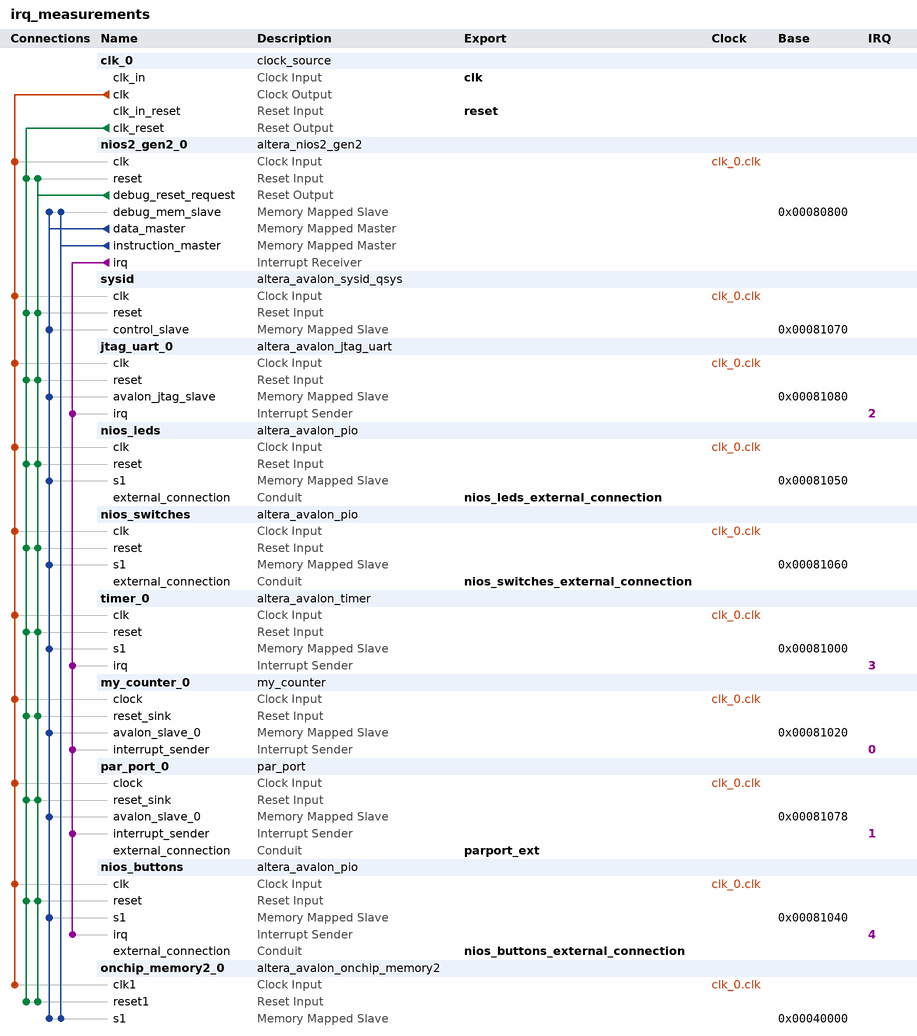
[diagram p0: system contents]
# Platform Designer (Qsys) system irq_measurements, Cyclone V 5CSEMA5F31C6
# Parameters at their usual value, and those the tool derives, are not listed.
package require -exact qsys 18.1
create_system irq_measurements
set_project_property DEVICE_FAMILY {Cyclone V}
set_project_property DEVICE 5CSEMA5F31C6

add_instance clk_0 clock_source 18.1
set_instance_parameter_value clk_0 clockFrequency 50000000

add_instance nios2_gen2_0 altera_nios2_gen2 18.1
set_instance_parameter_value nios2_gen2_0 dcache_size 2048
set_instance_parameter_value nios2_gen2_0 exceptionSlave onchip_memory2_0.s1
set_instance_parameter_value nios2_gen2_0 icache_size 4096
set_instance_parameter_value nios2_gen2_0 impl Fast
set_instance_parameter_value nios2_gen2_0 resetSlave onchip_memory2_0.s1

add_instance sysid altera_avalon_sysid_qsys 18.1
set_instance_parameter_value sysid id 0

add_instance jtag_uart_0 altera_avalon_jtag_uart 18.1
set_instance_parameter_value jtag_uart_0 simInteractiveOptions NO_INTERACTIVE_WINDOWS

add_instance nios_leds altera_avalon_pio 18.1
set_instance_parameter_value nios_leds direction Output
set_instance_parameter_value nios_leds width 10

add_instance nios_switches altera_avalon_pio 18.1
set_instance_parameter_value nios_switches direction Input
set_instance_parameter_value nios_switches width 10

add_instance timer_0 altera_avalon_timer 18.1
set_instance_parameter_value timer_0 period 1
set_instance_parameter_value timer_0 periodUnits MSEC

add_instance my_counter_0 my_counter 1.0

add_instance par_port_0 par_port 1.0

add_instance nios_buttons altera_avalon_pio 18.1
set_instance_parameter_value nios_buttons direction Input
set_instance_parameter_value nios_buttons generateIRQ true
set_instance_parameter_value nios_buttons width 3

add_instance onchip_memory2_0 altera_avalon_onchip_memory2 18.1
set_instance_parameter_value onchip_memory2_0 dataWidth 32
set_instance_parameter_value onchip_memory2_0 dualPort false
set_instance_parameter_value onchip_memory2_0 initMemContent true
set_instance_parameter_value onchip_memory2_0 initializationFileName onchip_mem.hex
set_instance_parameter_value onchip_memory2_0 memorySize 262144

# connections
add_connection clk_0.clk jtag_uart_0.clk clock
add_connection clk_0.clk my_counter_0.clock clock
add_connection clk_0.clk nios2_gen2_0.clk clock
add_connection clk_0.clk nios_buttons.clk clock
add_connection clk_0.clk nios_leds.clk clock
add_connection clk_0.clk nios_switches.clk clock
add_connection clk_0.clk onchip_memory2_0.clk1 clock
add_connection clk_0.clk par_port_0.clock clock
add_connection clk_0.clk sysid.clk clock
add_connection clk_0.clk timer_0.clk clock
add_connection clk_0.clk_reset jtag_uart_0.reset reset
add_connection clk_0.clk_reset my_counter_0.reset_sink reset
add_connection clk_0.clk_reset nios2_gen2_0.reset reset
add_connection clk_0.clk_reset nios_buttons.reset reset
add_connection clk_0.clk_reset nios_leds.reset reset
add_connection clk_0.clk_reset nios_switches.reset reset
add_connection clk_0.clk_reset onchip_memory2_0.reset1 reset
add_connection clk_0.clk_reset par_port_0.reset_sink reset
add_connection clk_0.clk_reset sysid.reset reset
add_connection clk_0.clk_reset timer_0.reset reset
add_connection nios2_gen2_0.debug_reset_request jtag_uart_0.reset reset
add_connection nios2_gen2_0.debug_reset_request my_counter_0.reset_sink reset
add_connection nios2_gen2_0.debug_reset_request nios2_gen2_0.reset reset
add_connection nios2_gen2_0.debug_reset_request nios_buttons.reset reset
add_connection nios2_gen2_0.debug_reset_request nios_leds.reset reset
add_connection nios2_gen2_0.debug_reset_request nios_switches.reset reset
add_connection nios2_gen2_0.debug_reset_request onchip_memory2_0.reset1 reset
add_connection nios2_gen2_0.debug_reset_request par_port_0.reset_sink reset
add_connection nios2_gen2_0.debug_reset_request sysid.reset reset
add_connection nios2_gen2_0.debug_reset_request timer_0.reset reset
add_connection nios2_gen2_0.data_master jtag_uart_0.avalon_jtag_slave avalon
set_connection_parameter_value nios2_gen2_0.data_master/jtag_uart_0.avalon_jtag_slave baseAddress 0x00081080
add_connection nios2_gen2_0.data_master my_counter_0.avalon_slave_0 avalon
set_connection_parameter_value nios2_gen2_0.data_master/my_counter_0.avalon_slave_0 baseAddress 0x00081020
add_connection nios2_gen2_0.data_master nios2_gen2_0.debug_mem_slave avalon
set_connection_parameter_value nios2_gen2_0.data_master/nios2_gen2_0.debug_mem_slave baseAddress 0x00080800
add_connection nios2_gen2_0.data_master nios_buttons.s1 avalon
set_connection_parameter_value nios2_gen2_0.data_master/nios_buttons.s1 baseAddress 0x00081040
add_connection nios2_gen2_0.data_master nios_leds.s1 avalon
set_connection_parameter_value nios2_gen2_0.data_master/nios_leds.s1 baseAddress 0x00081050
add_connection nios2_gen2_0.data_master nios_switches.s1 avalon
set_connection_parameter_value nios2_gen2_0.data_master/nios_switches.s1 baseAddress 0x00081060
add_connection nios2_gen2_0.data_master onchip_memory2_0.s1 avalon
set_connection_parameter_value nios2_gen2_0.data_master/onchip_memory2_0.s1 baseAddress 0x00040000
add_connection nios2_gen2_0.data_master par_port_0.avalon_slave_0 avalon
set_connection_parameter_value nios2_gen2_0.data_master/par_port_0.avalon_slave_0 baseAddress 0x00081078
add_connection nios2_gen2_0.data_master sysid.control_slave avalon
set_connection_parameter_value nios2_gen2_0.data_master/sysid.control_slave baseAddress 0x00081070
add_connection nios2_gen2_0.data_master timer_0.s1 avalon
set_connection_parameter_value nios2_gen2_0.data_master/timer_0.s1 baseAddress 0x00081000
add_connection nios2_gen2_0.instruction_master nios2_gen2_0.debug_mem_slave avalon
set_connection_parameter_value nios2_gen2_0.instruction_master/nios2_gen2_0.debug_mem_slave baseAddress 0x00080800
add_connection nios2_gen2_0.instruction_master onchip_memory2_0.s1 avalon
set_connection_parameter_value nios2_gen2_0.instruction_master/onchip_memory2_0.s1 baseAddress 0x00040000
add_connection nios2_gen2_0.irq jtag_uart_0.irq interrupt
set_connection_parameter_value nios2_gen2_0.irq/jtag_uart_0.irq irqNumber 2
add_connection nios2_gen2_0.irq my_counter_0.interrupt_sender interrupt
set_connection_parameter_value nios2_gen2_0.irq/my_counter_0.interrupt_sender irqNumber 0
add_connection nios2_gen2_0.irq nios_buttons.irq interrupt
set_connection_parameter_value nios2_gen2_0.irq/nios_buttons.irq irqNumber 4
add_connection nios2_gen2_0.irq par_port_0.interrupt_sender interrupt
set_connection_parameter_value nios2_gen2_0.irq/par_port_0.interrupt_sender irqNumber 1
add_connection nios2_gen2_0.irq timer_0.irq interrupt
set_connection_parameter_value nios2_gen2_0.irq/timer_0.irq irqNumber 3

# exported interfaces
add_interface clk clock sink
set_interface_property clk EXPORT_OF clk_0.clk_in
add_interface nios_buttons_external_connection conduit end
set_interface_property nios_buttons_external_connection EXPORT_OF nios_buttons.external_connection
add_interface nios_leds_external_connection conduit end
set_interface_property nios_leds_external_connection EXPORT_OF nios_leds.external_connection
add_interface nios_switches_external_connection conduit end
set_interface_property nios_switches_external_connection EXPORT_OF nios_switches.external_connection
add_interface parport_ext conduit end
set_interface_property parport_ext EXPORT_OF par_port_0.external_connection
add_interface reset reset sink
set_interface_property reset EXPORT_OF clk_0.clk_in_reset

set_interconnect_requirement {$system} qsys_mm.clockCrossingAdapter HANDSHAKE
set_interconnect_requirement {$system} qsys_mm.enableEccProtection FALSE
set_interconnect_requirement {$system} qsys_mm.insertDefaultSlave FALSE
set_interconnect_requirement {$system} qsys_mm.maxAdditionalLatency 1

save_system irq_measurements.qsys
